# Altium schematic sheet MCU.SchDoc
size Legal; Author: Lihong; Chenwei; SheetNumber: 3; SheetTotal: 8
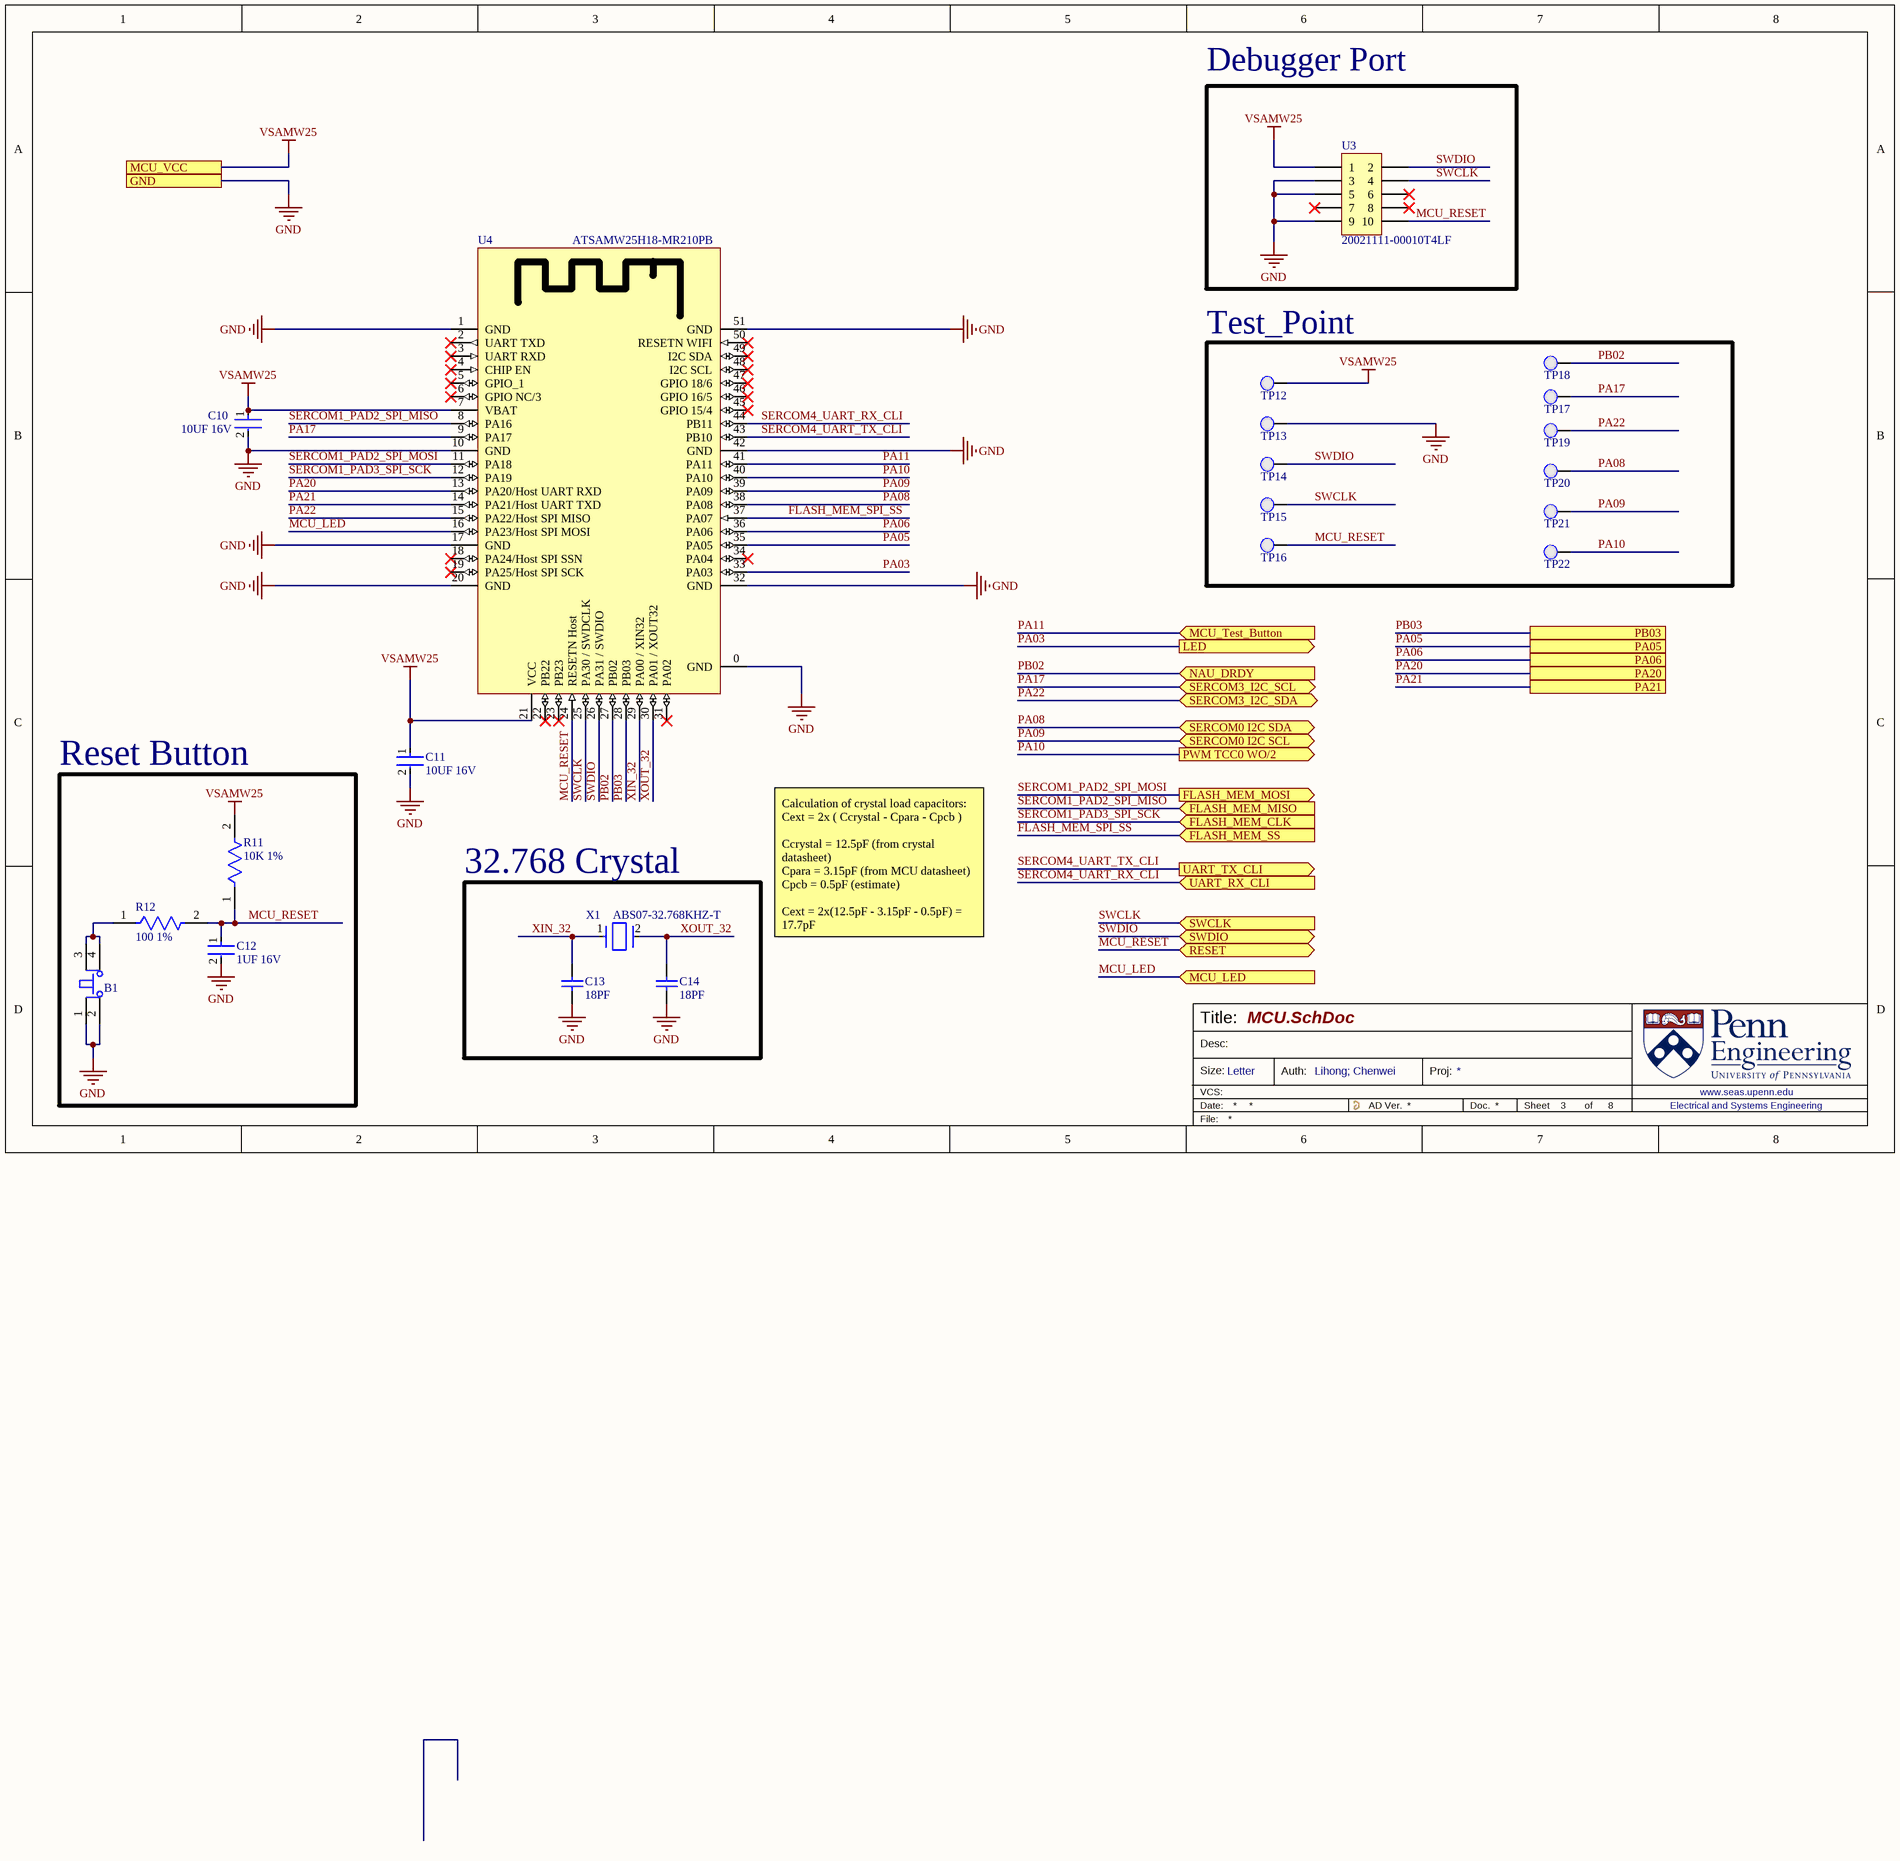
[diagram p0: MCU.SchDoc]

## Parts
B1  PTS810SJK250SMTRLFS  [PTS810SJK250SMTRLFS-Footprint-1]  (value not drawn)
C10  10UF 16V  [FP-CC0603-DB-MFG]
C11  10UF 16V  [FP-CC0603-DB-MFG]
C12  1UF 16V  [FP-CC0603-DA-MFG]
C13  18PF  [CAPC1608X90X40LL10T20]
C14  18PF  [CAPC1608X90X40LL10T20]
R11  10K 1%  [FP-RNCP0603-IPC_A]
R12  100 1%  [FP-RMCF0603-IPC_C]
TP12  Test Point 0.1"  [Test Point 0.1"-Footprint-1]  (value not drawn)
TP13  Test Point 0.1"  [Test Point 0.1"-Footprint-1]  (value not drawn)
TP14  Test Point 0.1"  [Test Point 0.1"-Footprint-1]  (value not drawn)
TP15  Test Point 0.1"  [Test Point 0.1"-Footprint-1]  (value not drawn)
TP16  Test Point 0.1"  [Test Point 0.1"-Footprint-1]  (value not drawn)
TP17  Test Point 0.1"  [Test Point 0.1"-Footprint-1]  (value not drawn)  (no BOM)
TP18  Test Point 0.1"  [Test Point 0.1"-Footprint-1]  (value not drawn)  (no BOM)
TP19  Test Point 0.1"  [Test Point 0.1"-Footprint-1]  (value not drawn)  (no BOM)
TP20  Test Point 0.1"  [Test Point 0.1"-Footprint-1]  (value not drawn)  (no BOM)
TP21  Test Point 0.1"  [Test Point 0.1"-Footprint-1]  (value not drawn)  (no BOM)
TP22  Test Point 0.1"  [Test Point 0.1"-Footprint-1]  (value not drawn)  (no BOM)
U3  20021111-00010T4LF  [20021111-00010T4LF-Footprint-1]
U4  ATSAMW25H18-MR210PB  [SAMW25H18-MR510PB-Footprint-1]
X1  ABS07-32.768KHZ-T  [FP-ABS07-MFG]

## Blocks framed on the sheet
Debugger Port: U3
Test_Point: TP12-TP22
Reset Button: B1 C12 R11 R12
32.768 Crystal: C13 C14 X1

## Ports
FLASH_MEM_CLK (in), FLASH_MEM_MISO (in), FLASH_MEM_MOSI (out), FLASH_MEM_SS (in), GND, LED (out), MCU_LED (in), MCU_Test_Button (in), MCU_VCC, NAU_DRDY (in), PA05, PA06, PA20, PA21, PB03, PWM TCC0 WO/2 (out), RESET (bidir), SERCOM0 I2C SCL (bidir), SERCOM0 I2C SDA (bidir), SERCOM3_I2C_SCL (bidir), SERCOM3_I2C_SDA (bidir), SWCLK (in), SWDIO (bidir), UART_RX_CLI (in), UART_TX_CLI (out)

## Nets
GND: B1.1 B1.2 C10.2 C11.2 C12.2 C13.1 C14.2 TP13.1(PAD) U3.3 U3.5 U3.9 U4.0(GND) U4.1(GND) U4.10(GND) U4.17(GND) U4.20(GND) U4.32(GND) U4.42(GND) U4.51(GND) ; port GND
VSAMW25: C10.1 C11.1 R11.2 TP12.1(PAD) U3.1 U4.7(VBAT) U4.21(VCC) ; port MCU_VCC
FLASH_MEM_SPI_SS: U4.37(PA07) ; port FLASH_MEM_SS
MCU_LED: U4.16(PA23/Host_SPI_MOSI) ; port MCU_LED
MCU_RESET: C12.1 R11.1 R12.2 TP16.1(PAD) U3.10 U4.24(RESETN_Host) ; port RESET
PA03: U4.33(PA03) ; port LED
PA05: U4.35(PA05) ; port PA05
PA06: U4.36(PA06) ; port PA06
PA08: TP20.1(PAD) U4.38(PA08) ; port SERCOM0 I2C SDA
PA09: TP21.1(PAD) U4.39(PA09) ; port SERCOM0 I2C SCL
PA10: TP22.1(PAD) U4.40(PA10) ; port PWM TCC0 WO/2
PA11: U4.41(PA11) ; port MCU_Test_Button
PA17: TP17.1(PAD) U4.9(PA17) ; port SERCOM3_I2C_SCL
PA20: U4.13(PA20/Host_UART_RXD) ; port PA20
PA21: U4.14(PA21/Host_UART_TXD) ; port PA21
PA22: TP19.1(PAD) U4.15(PA22/Host_SPI_MISO) ; port SERCOM3_I2C_SDA
PB02: TP18.1(PAD) U4.27(PB02) ; port NAU_DRDY
PB03: U4.28(PB03) ; port PB03
SERCOM1_PAD2_SPI_MISO: U4.8(PA16) ; port FLASH_MEM_MISO
SERCOM1_PAD2_SPI_MOSI: U4.11(PA18) ; port FLASH_MEM_MOSI
SERCOM1_PAD3_SPI_SCK: U4.12(PA19) ; port FLASH_MEM_CLK
SERCOM4_UART_RX_CLI: U4.44(PB11) ; port UART_RX_CLI
SERCOM4_UART_TX_CLI: U4.43(PB10) ; port UART_TX_CLI
SWCLK: TP15.1(PAD) U3.4 U4.25(PA30_/_SWDCLK) ; port SWCLK
SWDIO: TP14.1(PAD) U3.2 U4.26(PA31_/_SWDIO) ; port SWDIO
XIN_32: C13.2 U4.29(PA00_/_XIN32) X1.1
XOUT_32: C14.1 U4.30(PA01_/_XOUT32) X1.2
NetB1_3: B1.3 B1.4 R12.1

Not connected (* = marked no-connect by the designer): U3 6* 7* 8*; U4 2(UART_TXD)* 3(UART_RXD)* 4(CHIP_EN)* 5(GPIO_1)* 6(GPIO_NC/3)* 18(PA24/Host_SPI_SSN)* 19(PA25/Host_SPI_SCK)* 22(PB22)* 23(PB23)* 31(PA02)* 34(PA04)* 45(GPIO_15/4)* 46(GPIO_16/5)* 47(GPIO_18/6)* 48(I2C_SCL)* 49(I2C_SDA)* 50(RESETN_WIFI)*

## Notes on the sheet
- Calculation of crystal load capacitors:
  Cext = 2x ( Ccrystal - Cpara - Cpcb )
  Ccrystal = 12.5pF (from crystal datasheet)
  Cpara = 3.15pF (from MCU datasheet)
  Cpcb = 0.5pF (estimate)
  Cext = 2x(12.5pF - 3.15pF - 0.5pF) = 17.7pF
- Title:
- Desc:
- Size:
- Letter
- Auth:
- Proj:
- Sheet
- of
- www.seas.upenn.edu
- Electrical and Systems Engineering

## Library data of the parts
B1 = CMP-00084-2: Keypad Switch, 1 Switches, SPST, Momentary-tactile, 0.05A, 16VDC, 3.23N, Solder Terminal, Surface Mount-straight; Manufacturer Series: PTS810; Actuator Length: 0.028inch; Electrical Life: 50000Cycles; Contact Resistance: 0.5mR; Solderability: REFLOW; Actuator Travel: 0.1524mm; Actuator Color: White; Actuator Type: Pushbutton; Insulation Resistance: 100MR; Dielectric Withstand Volts: 250VACV; Switch Function: OFF-MOM; Reach SVHC Compliant: Yes; Terminal Finish: Silver; Switch Type: Keypad; Switch Action: MOMENTARY; RoHS Compliant: Yes; JESD-609 Code: e4; Max Operating Temperature: 85°C; Termination: Solder; Min Operating Temperature: -40°C; Mounting Technology: Surface Mount; Circuit: SPST; Type: Tactile
C10 C11 = CMP-1035-02797-2: CAP CER 10UF 6.3V X5R 0603; Dissipation Factor: 10%; Tolerance: 20%; Depth: 0.8mm; Dielectric: X5R; Height: 0.8mm; Min Operating Temperature: -55°C; Package Quantity: 4000; Radiation Hardening: No; Mount: Surface Mount; Termination: SMD/SMT; Case/Package: 0603; Max Operating Temperature: 85°C; Case Code (Imperial): 0603; RoHS Compliant: Yes; Number of Pins: 2; Lead Free: Lead Free; Resistor Type: Ceramic; Thickness: 0.039inch; Construction: Flat; Width: 0.031inch; Length: 1.6mm; Capacitance: 10uF; Voltage Rating: 6.3V; Series: CC; REACH SVHC: No SVHC; Packaging: Tape and Reel; Case Code (Metric): 1608; Voltage Rating (DC): 6.3V; Halogen Free: Halogen Free
C12 = CMP-03422-001047-1: CC0603 1 uF X7R 10.00% 16 V; Manufacturer: YAGEO; Manufacturer Part Number: CC0603KPX7R7BB105; Temperature Coefficient: 15%; Tolerance: 0.1; Material: Ceramic; Device Class L3: Ceramic Capacitors; Temperature Characteristic: X7R; Device Class L2: Capacitors; Temperature Range Low: -55°C; Footprint Url: http://www.yageo.com/exep/pages/download/literatures/UPY-C_GEN_24.pdf; Device Class L1: Passive Components; Temperature: -55°C to +125°C; Voltage Rating: 16 V; RoHS: TRUE; ComponentLink2URL: http://www.yageo.com/documents/recent/UPY-GPHC_X7R_6.3V-to-50V_18.pdf; Mouser Description: Cap Ceramic 1uF 16V X7R 10% SMD 0603 125°C Paper T/R; Octopart: https://octopart.com/cc0603kpx7r7bb105-yageo-25629533; Automotive: No; Capacitance: 1 uF; Height: 0.9mm; Voltage: 16 V; Lead Free: Yes; Category: Cap; Package: CC0603-DA; Temperature Range High: +125°C; Value: 1 uF; ComponentLink2Description: Datasheet
C13 C14 = CMP-1659-00030-1: Chip Capacitor, 18 pF, +/- 5%, 50 V, -55 to 125 degC, 0603 (1608 Metric), RoHS, Tape and Reel; Voltage Rating: 50 V; Case\Package: 0603; Power Rating: 100 mW; Resistance: 68.1 Ohm; Tolerance: 1%; Case Code (Metric): 1608; Max Operating Temperature: 155 degC; RoHSCompliant: true; Case Code (Imperial): 0603; ComponentLink2Description: Datasheet; Package Quantity: 200; PackageReference: 0603; ComponentLink2URL: http://www.yageo.com/NewPortal/yageodocoutput?fileName=/pdf/MLCC/UPY-GP_NP0_16V-to-50V_14.pdf; Length: 1.6 mm; DatasheetVersion: Rev. 14, 07/2016; Min Operating Temperature: -55 degC; ComponentLink1URL: http://www.yageo.com/; Width: 0.8 mm; ComponentLink1Description: Manufacturer URL; Height: 0.45 mm; Radiation Hardening: No; PackageDescription: 2-Pin Surface Mount Device, Body 1.6 x 0.8 mm; Packaging: Tape and Reel
R11 = CMP-26527-000099-1: 10kΩ ±1% 0.125W 0603 High Power Anti-Sulfur Thin Film Chip Resistor; Resistance: 10kR; Max Power Dissipation: 125mW; Temperature Coefficient: 100ppm/°C; Max Operating Temperature: 155°C; Width: 0.031inch; Height: 0.02inch; Lead Free: Lead Free; Contact Plating: Tin; Tolerance: 1%; Resistor Type: Thin Film; Series: RNCP; RoHS Compliant: Yes; Features: Moisture Resistant; Min Operating Temperature: -55°C; Case Code (Metric): 1608; Case/Package: 0603; Mount: Surface Mount; Packaging: Tape and Reel; Radiation Hardening: No; Length: 0.059inch; Number of Terminations: 2; Case Code (Imperial): 0603
R12 = CMP-26527-006079-1: 100Ω ±1% 0.1W 0603 Thick Film Chip Resistor AEC-Q200 compliant; Resistance: 100R; Power Rating: 100mW; Temperature Coefficient: 100ppm/°C; Radiation Hardening: No; Case Code (Metric): 1608; RoHS Compliant: Yes; Height: 0.022inch; Case/Package: 0603; Construction: Rectangular; Case Code (Imperial): 0603; Series: RMCF; Military Standard: Not; Max Operating Temperature: 155°C; Resistor Type: Thick Film; Depth: 0.8mm; Features: Automotive AEC-Q200; Width: 0.031inch; Length: 1.55mm; Size Code: 0603; Mount: Surface Mount; Contact Plating: Tin; Max Power Dissipation: 100mW; Number of Terminations: 2; Min Operating Temperature: -55°C; Packaging: Tape and Reel; Lead Free: Lead Free; Tolerance: 1%
TP12-TP22 = CMP-00086-1
U3 = CMP-00083-1: Board Connector, 10 Contact(s), 2 Row(s), Male, Straight, 0.05 inch Pitch, Solder Terminal, Locking, Black Insulator, Receptacle; Number Of PCB Rows: 2; PCB Contact Pattern: RECTANGULAR; Option: General Purpose; Body Depth: 0.098inch; Insulation Resistance: 100MR; Dielectric Withstanding Voltage (AC): 700V; Withdrawl Force-Min: 0.1946N; Body Length: 0.25inch; IEC Conformance: No; Body Breadth: 0.135inch; Rated Current (Signal): 1A; Plating Thickness: 10uin; Reliability: COMMERCIAL; Number Of Connectors: 1; PCB Contact Row Spacing: 1.27mm; Insertion Force-Max: 2.1406N; Contact Style: SQ PIN-SKT; Durability: 100Cycles; Contact Resistance: 30mR; Number of Contacts: 10; Reference Standard: UL; Insulation Material: Thermoplastic; Connector Type: BOARD CONNECTOR; Termination: Solder; Contact Finish - Mating: GOLD (10); Mounting Technology: Board; RoHS Compliant: Yes; Terminal Length: 0.091inch; Body/Shell Style: RECEPTACLE; Number of Rows Loaded: 2; Contact Gender: Male; Terminal Pitch: 1.27mm; Max Operating Temperature: 125°C; Mounting Option 1: LOCKING; JESD-609 Code: e3; DIN Conformance: No; Reach SVHC Compliant: Yes; Contact Finish - Termination: Matte Tin (Sn); Mounting Style: STRAIGHT; Min Operating Temperature: -40°C; MIL Conformance: No; Contact Material: Copper Alloy; Filter Feature: No; Mating Contact Pitch: 0.05inch; Insulation Color: Black; Flammability Rating: UL94 V-0; Mating Contact Row Spacing: 0.05inch; Mixed Contacts: No; Contact Pattern: RECTANGULAR
U4 = CMP-00082-2: 2.7 - 4.2 V 65 Mbps 17 dbm 256 kB Flash 32 kB SRAM 802.11 b/g/n Smart Module
X1 = CMP-0447-00001-4: Crystal 32.768kHz ±20ppm (Tol) 12.5pF FUND 70kΩ 2-Pin CSMD T/R; ESR (Equivalent Series Resistance): 70kR; Frequency: 32.768kHz; Radiation Hardening: No; Length: 3.2mm; Max Operating Temperature: 85°C; Number of Pins: 2; Series: ABS07; Min Operating Temperature: -40°C; Frequency Tolerance: 20ppm; Packaging: Tape and Reel; Height: 0.9mm; Width: 1.5mm; Depth: 1.5mm; Load Capacitance: 12.5pF; RoHS Compliant: Yes; Tolerance: 20ppm; Termination: SMD/SMT; Lead Free: Lead Free; Series Resistance: 70kR; REACH SVHC: No SVHC; Case/Package: CSMD; Operating Frequency: 32.768 kHz; Package Quantity: 3000